# Altium project SOC v2.PrjPcb
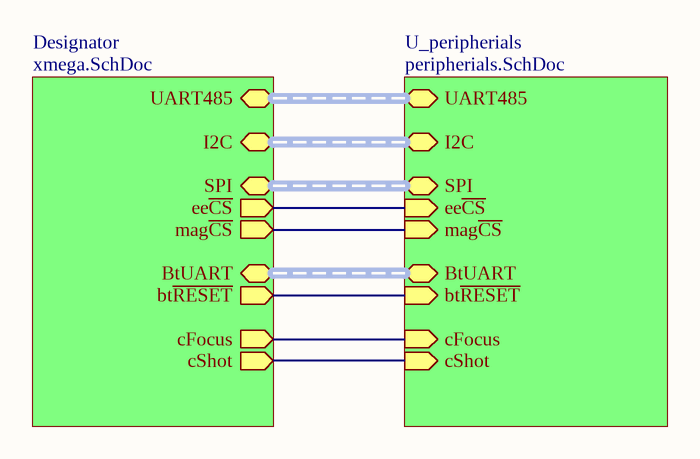
[diagram p0: schematics.SchDoc]
3 sheets, 97 parts. Net scope: hierarchical (ports join the sheet entries above them; power ports are global).
Board file: PtHeadMB.PcbDoc
Sheets:
  schematics.SchDoc
    Designator = xmega.SchDoc
    U_peripherials = peripherials.SchDoc

## Sheet schematics.SchDoc: Automatická videohlava
size A4; ApprovedBy: app by; CheckedBy: check by; Author: author; CompanyName: company; DrawnBy: Jiří Kyzlink; Organization: SPŠE Brno, Kounicova 16; Address1: L3, 12a Rodborough Rd; Address2: Frenchs Forest; Address3: NSW; Address4: Australia 2086; DocumentNumber: 1; Revision: A; SheetNumber: 1; SheetTotal: 3; DocumentName: doc name; ProjectName: hlava

### Sub-sheets
Designator = xmega.SchDoc: I2C (harness I2C), UART485 (harness UART485), BtUART (harness UART), SPI (harness SPI), ee~{CS} (out), mag~{CS} (out), bt~{RESET} (out), cFocus (out), cShot (out)
U_peripherials = peripherials.SchDoc: I2C (harness I2C), UART485 (harness rs485), SPI (harness SPI), BtUART (harness UART), ee~{CS} (in), mag~{CS} (in), bt~{RESET} (in), cShot (in), cFocus (in)

### Nets
~{mCS}: sheet Designator/mag~{CS}, sheet U_peripherials/mag~{CS}
NetQ1#1_5: sheet Designator/cShot, sheet U_peripherials/cShot
NetQ1#2_2: sheet Designator/cFocus, sheet U_peripherials/cFocus
NetR25_1: sheet Designator/ee~{CS}, sheet U_peripherials/ee~{CS}
NetU1_20: sheet Designator/bt~{RESET}, sheet U_peripherials/bt~{RESET}

### Buses and harness runs
harness sheet Designator/BtUART = sheet U_peripherials/BtUART
harness sheet Designator/I2C = sheet U_peripherials/I2C
harness sheet Designator/SPI = sheet U_peripherials/SPI
harness sheet Designator/UART485 = sheet U_peripherials/UART485

### Notes on the sheet
- Date:
- Size:
- Title
- A4
- Draw:
- Time:
- Revision:
- Sheet
- of
- File:

## Sheet xmega.SchDoc: Automatická videohlava
size A4; ApprovedBy: app by; CheckedBy: check by; Author: author; CompanyName: company; DrawnBy: Jiří Kyzlink; Organization: SPŠE Brno Kounicova 16; Address1: L3, 12a Rodborough Rd; Address2: Frenchs Forest; Address3: NSW; Address4: Australia 2086; DocumentNumber: 2; Revision: A; SheetNumber: 2; SheetTotal: 3; DocumentName: Sch; ProjectName: Hlava
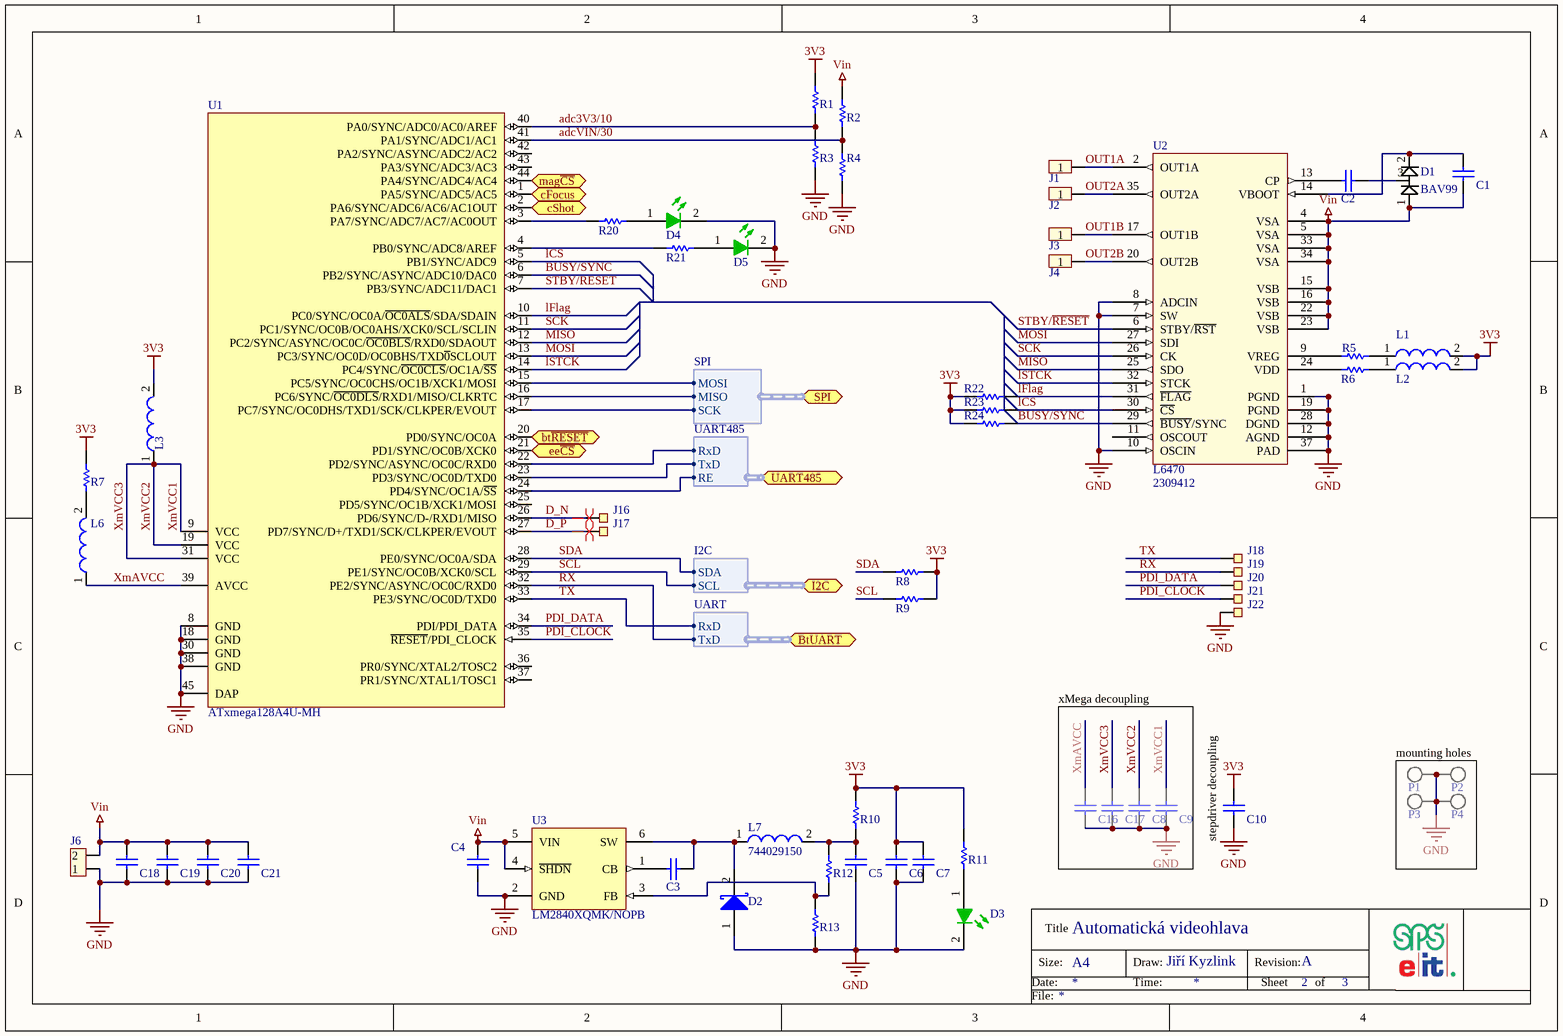
[diagram p1: xmega.SchDoc]

### Parts
C1  CAP 220nF 50V 0603(1608)  [CAPC0603(1608)100_L]  (value not drawn)
C2  CAP 10nF 16V 0402(1005)  [CAPC0402(1005)60_L]  (value not drawn)
C3  CAP 100nF 16V 0402(1005)  [CAPC0402(1005)60_L]  (value not drawn)
C4  CAP 2.2pF 50V 0402(1005)  [CAPC0402(1005)60_L]  (value not drawn)
C5  CAP 10uF 6.3V 0402(1005)  [CAPC0402(1005)60_L]  (value not drawn)
C6  CAP 10uF 6.3V 0402(1005)  [CAPC0402(1005)60_L]  (value not drawn)
C7  CAP 10uF 6.3V 0402(1005)  [CAPC0402(1005)60_L]  (value not drawn)
C8  CAP 100nF 6.3V 0402(1005)  [CAPC0402(1005)60_L]  (value not drawn)
C9  CAP 100nF 6.3V 0402(1005)  [CAPC0402(1005)60_L]  (value not drawn)
C10  CAP 100nF 6.3V 0402(1005)  [CAPC0402(1005)60_L]  (value not drawn)
C16  CAP 100nF 16V 0402(1005)  [CAPC0402(1005)60_L]  (value not drawn)
C17  CAP 100nF 6.3V 0402(1005)  [CAPC0402(1005)60_L]  (value not drawn)
C18  CAP 1uF 50V 0603(1608)  [CAPC0603(1608)100_L]  (value not drawn)
C19  CAP 1uF 50V 0603(1608)  [CAPC0603(1608)100_L]  (value not drawn)
C20  CAP 1uF 50V 0603(1608)  [CAPC0603(1608)100_L]  (value not drawn)
C21  CAP 1uF 50V 0603(1608)  [CAPC0603(1608)100_L]  (value not drawn)
D1  BAV99  [MCHP-SOT-23-NB3_N]
D2  ZHCS400  [DIOD-SOD323-2_V]  (value not drawn)
D3  KP-1608MGC  [KING-0603LED_GREEN_V]  (value not drawn)
D4  KP-1608MGC  [KING-0603LED_GREEN_V]  (value not drawn)
D5  KP-1608MGC  [KING-0603LED_GREEN_V]  (value not drawn)
J1  Pin  [Hole 1mm]  (value not drawn)
J2  Pin  [Hole 1mm]  (value not drawn)
J3  Pin  [Hole 1mm]  (value not drawn)
J4  Pin  [Hole 1mm]  (value not drawn)
J6  jumper  [header 2pin]  (value not drawn)
J16  smd pad  [pad 0.75x1.5mm]  (value not drawn)
J17  smd pad  [pad 0.75x1.5mm]  (value not drawn)
J18  smd pad  [pad 0.75x1.5mm]  (value not drawn)
J19  smd pad  [pad 0.75x1.5mm]  (value not drawn)
J20  smd pad  [pad 0.75x1.5mm]  (value not drawn)
J21  smd pad  [pad 0.75x1.5mm]  (value not drawn)
J22  smd pad  [pad 0.75x1.5mm]  (value not drawn)
L1  742843122  [0402]  (value not drawn)
L2  742843122  [0402]  (value not drawn)
L3  742843122  [0402]  (value not drawn)
L6  742843122  [0402]  (value not drawn)
L7  744029150  [WE-TPC-2813-TH]
P1  screw  [M3 screw]  (value not drawn)
P2  screw  [M3 screw]  (value not drawn)
P3  screw  [M3 screw]  (value not drawn)
P4  screw  [M3 screw]  (value not drawn)
R1  10K 1% 0402(1005)  [RESC0402(1005)_L]  (value not drawn)
R2  30K 1% 0402(1005)  [RESC0402(1005)_L]  (value not drawn)
R3  1K 1% 0402(1005)  [RESC0402(1005)_L]  (value not drawn)
R4  1K 1% 0402(1005)  [RESC0402(1005)_L]  (value not drawn)
R5  Jumper 0402(1005)  [RESC0402(1005)_L]  (value not drawn)
R6  Jumper 0402(1005)  [RESC0402(1005)_L]  (value not drawn)
R7  Jumper 0402(1005)  [RESC0402(1005)_L]  (value not drawn)
R8  4K7 1% 0402(1005)  [RESC0402(1005)_L]  (value not drawn)
R9  4K7 1% 0402(1005)  [RESC0402(1005)_L]  (value not drawn)
R10  Jumper 0402(1005)  [RESC0402(1005)_L]  (value not drawn)
R11  130R 5% 0402(1005)  [RESC0402(1005)_L]  (value not drawn)
R12  1K02 1% 0402(1005)  [RESC0402(1005)_L]  (value not drawn)
R13  3K4 1% 0402(1005)  [RESC0402(1005)_L]  (value not drawn)
R20  130R 5% 0402(1005)  [RESC0402(1005)_L]  (value not drawn)
R21  130R 5% 0402(1005)  [RESC0402(1005)_L]  (value not drawn)
R22  39K 5% 0402(1005)  [RESC0402(1005)_L]  (value not drawn)
R23  39K 5% 0402(1005)  [RESC0402(1005)_L]  (value not drawn)
R24  39K 5% 0402(1005)  [RESC0402(1005)_L]  (value not drawn)
U1  ATxmega128A4U-MH  [qfn 44pin]
U2  L6470  Supplier Part Number 1: 2309412  [POWERSO36]
U3  LM2840XQMK/NOPB  [MK06A_N]

### Blocks framed on the sheet
xMega decoupling: C8 C9 C16 C17
mounting holes: P1-P4

### Ports
BtUART (harness UART), bt~{RESET} (out), cFocus (out), cShot (out), ee~{CS} (out), I2C (harness I2C), mag~{CS} (out), SPI (harness SPI), UART485 (harness UART485)

### Harnesses
I2C: SCL, SDA
UART485: TxD, RxD, RE
UART: RxD, TxD
SPI: MOSI, MISO, SCK

### Nets
3V3: C6.2 C7.2 C10.1 L1.2 L2.2 L3.2 R1.2 R7.2 R8.2 R9.1 R10.2 R11.2 R22.1 R23.1 R24.1
GND: C4.1 C5.1 C6.1 C7.1 C8.2 C9.2 C10.2 C16.2 C17.2 C18.1 C19.1 C20.1 C21.1 D2.1(A) D3.2(K) D4.2(K) D5.2(K) J6.1 J22.0 P1.0 P2.0 P3.0 P4.0 R3.2 R4.2 R13.1 U1.8(GND) U1.18(GND) U1.30(GND) U1.38(GND) U1.45(DAP) U2.1(PGND) U2.7(SW) U2.8(ADCIN) U2.10(OSCIN) U2.12(AGND) U2.19(PGND) U2.28(DGND) U2.37(PAD) U3.2(GND)
Vin: C1.1 C4.2 C18.2 C19.2 C20.2 C21.2 D1.1 J6.2 R2.2 U2.4(VSA) U2.5(VSA) U2.15(VSB) U2.16(VSB) U2.22(VSB) U2.23(VSB) U2.33(VSA) U2.34(VSA) U3.4(~{SHDN}) U3.5(VIN)
adc3V3/10: R1.1 R3.1 U1.40(PA0/SYNC/ADC0/AC0/AREF)
adcVIN/30: R2.1 R4.1 U1.41(PA1/SYNC/ADC1/AC1)
BUSY/~{SYNC}: R24.2 U1.6(PB2/SYNC/ASYNC/ADC10/DAC0) U2.29(~{BUSY}/SYNC)
D_N: J16.0 U1.26(PD6/SYNC/D-/RXD1/MISO)
D_P: J17.0 U1.27(PD7/SYNC/D+/TXD1/SCK/CLKPER/EVOUT)
lCS: R23.2 U1.5(PB1/SYNC/ADC9) U2.30(~{CS})
lFlag: R22.2 U1.10(PC0/SYNC/OC0A/~{OC0ALS}/SDA/SDAIN) U2.31(~{FLAG})
lSTCK: U1.14(PC4/SYNC/~{OC0CLS}/OC1A/~{SS}) U2.32(STCK)
~{mCS}: U1.44(PA4/SYNC/ADC4/AC4) ; port mag~{CS}
MISO: U1.12(PC2/SYNC/ASYNC/OC0C/~{OC0BLS}/RXD0/SDAOUT) U2.25(SDO)
MISO: U1.16(PC6/SYNC/~{OC0DLS}/RXD1/MISO/CLKRTC) ; port SPI.MISO  [a separate net that carries the same name]
MOSI: U1.13(PC3/SYNC/OC0D/OC0BHS/TXD~{0}SCLOUT) U2.27(SDI)
MOSI: U1.15(PC5/SYNC/OC0CHS/OC1B/XCK1/MOSI) ; port SPI.MOSI  [a separate net that carries the same name]
OUT1A: J1.1 U2.2(OUT1A)
OUT1B: J3.1 U2.17(OUT1B)
OUT2A: J2.1 U2.35(OUT2A)
OUT2B: J4.1 U2.20(OUT2B)
PDI_CLOCK: J21.0 U1.35(~{RESET}/PDI_CLOCK)
PDI_DATA: J20.0 U1.34(PDI/PDI_DATA)
RX: J19.0 U1.32(PE2/SYNC/ASYNC/OC0C/RXD0) ; port BtUART.TxD
SCK: U1.11(PC1/SYNC/OC0B/OC0AHS/XCK0/SCL/SCLIN) U2.26(CK)
SCK: U1.17(PC7/SYNC/OC0DHS/TXD1/SCK/CLKPER/EVOUT) ; port SPI.SCK  [a separate net that carries the same name]
SCL: R9.2 U1.29(PE1/SYNC/OC0B/XCK0/SCL) ; port I2C.SCL
SDA: R8.1 U1.28(PE0/SYNC/OC0A/SDA) ; port I2C.SDA
STBY/~{RESET}: U1.7(PB3/SYNC/ADC11/DAC1) U2.6(STBY/~{RST})
TX: J18.0 U1.33(PE3/SYNC/OC0D/TXD0) ; port BtUART.RxD
XmAVCC: C16.1 L6.1 U1.39(AVCC)
XmVCC1: C8.1 C9.1 C17.1 L3.1 U1.9(VCC) U1.19(VCC) U1.31(VCC)  [also labelled XmVCC2, XmVCC3]
NetC1_2: C1.2 D1.2 U2.14(VBOOT)
NetC2_1: C2.1 U2.13(CP)
NetC2_2: C2.2 D1.3
NetC3_1: C3.1 U3.1(CB)
NetC3_2: C3.2 D2.2(K) L7.1 U3.6(SW)
NetC5_2: C5.2 L7.2 R10.1 R12.2
NetD3_1: D3.1(A) R11.1
NetD4_1: D4.1(A) R20.2
NetD5_1: D5.1(A) R21.2
NetL1_1: L1.1 R5.2
NetL2_1: L2.1 R6.2
NetL6_2: L6.2 R7.1
NetQ1#1_5: U1.2(PA6/SYNC/ADC6/AC6/AC1OUT) ; port cShot
NetQ1#2_2: U1.1(PA5/SYNC/ADC5/AC5) ; port cFocus
NetR5_1: R5.1 U2.9(VREG)
NetR6_1: R6.1 U2.24(VDD)
NetR12_1: R12.1 R13.2 U3.3(FB)
NetR20_1: R20.1 U1.3(PA7/SYNC/ADC7/AC7/AC0OUT)
NetR21_1: R21.1 U1.4(PB0/SYNC/ADC8/AREF)
NetR25_1: U1.21(PD1/SYNC/OC0B/XCK0) ; port ee~{CS}
NetU1_20: U1.20(PD0/SYNC/OC0A) ; port bt~{RESET}
NetU1_22: U1.22(PD2/SYNC/ASYNC/OC0C/RXD0) ; port UART485.RxD
NetU1_23: U1.23(PD3/SYNC/OC0D/TXD0) ; port UART485.TxD
NetU1_24: U1.24(PD4/SYNC/OC1A/~{SS}) ; port UART485.RE

Not connected (* = marked no-connect by the designer): U1 25(PD5/SYNC/OC1B/XCK1/MOSI) 36(PR0/SYNC/XTAL2/TOSC2) 37(PR1/SYNC/XTAL1/TOSC1) 42(PA2/SYNC/ASYNC/ADC2/AC2) 43(PA3/SYNC/ADC3/AC3); U2 11(OSCOUT)

### Layout directives
differential pair: D_N, D_P

### Notes on the sheet
- (near C10) stepdriver decoupling
- Date:
- Size:
- Title
- A4
- Draw:
- Time:
- Revision:
- Sheet
- of
- File:

### Library data of the parts
C1 = CMP-1035-02654-1: CAP 220nF 50V ±20% 0603 (1608 Metric) Thickness 1mm SMD; Case-Metric: 1608; Case-EIA: 0603; Max Thickness: 1 mm; Rated Voltage: 50 V; Value: 220nF; Tolerance: ±20%; Technology: SMT
C2 = CMP-1034-01876-1: CAP 10nF 16V ±10% 0402 (1005 Metric) Thickness 0.6mm SMD; Case-EIA: 0402; Case-Metric: 1005; Tolerance: ±10%; Rated Voltage: 16 V; Max Thickness: 0.6 mm; Technology: SMT; Value: 10nF
C3 C16 = CMP-1034-02069-1: CAP 100nF 16V ±10% 0402 (1005 Metric) Thickness 0.6mm SMD; Case-EIA: 0402; Case-Metric: 1005; Value: 100nF; Max Thickness: 0.6 mm; Tolerance: ±10%; Rated Voltage: 16 V; Technology: SMT
C4 = CMP-1034-00178-1: CAP 2.2pF 50V ±2% 0402 (1005 Metric) Thickness 0.6mm SMD; Case-Metric: 1005; Case-EIA: 0402; Max Thickness: 0.6 mm; Tolerance: ±2%; Technology: SMT; Value: 2.2pF; Rated Voltage: 50 V
C5-C7 = CMP-1034-02138-1: CAP 10uF 6.3V ±20% 0402 (1005 Metric) Thickness 0.6mm SMD; Case-Metric: 1005; Case-EIA: 0402; Tolerance: ±20%; Rated Voltage: 6.3 V; Technology: SMT; Max Thickness: 0.6 mm; Value: 10uF
C8-C10 C17 = CMP-1034-02060-1: CAP 100nF 6.3V ±5% 0402 (1005 Metric) Thickness 0.6mm SMD; Case-EIA: 0402; Case-Metric: 1005; Rated Voltage: 6.3 V; Max Thickness: 0.6 mm; Value: 100nF; Tolerance: ±5%; Technology: SMT
C18-C21 = CMP-1035-02745-1: CAP 1uF 50V ±10% 0603 (1608 Metric) Thickness 1mm SMD; Case-EIA: 0603; Case-Metric: 1608; Technology: SMT; Value: 1uF; Rated Voltage: 50 V; Max Thickness: 1 mm; Tolerance: ±10%
D2 = CMP-0303-00001-1: Schottky Diode, 400mA; Manufacturer: Diodes Inc; Reverse Voltage: 40 V; Power Dissipation: 250 mW; Reverse Current: 40 uA@Vr=30 V; Packing Type: Tape and Reel; Forward Voltage: 425 mV@If=400 mA; PartNumber: ZHCS400; Moisture Sensitivity Level: 1; ComponentLink2URL: http://www.diodes.com/datasheets/ZHCS400.pdf; PackageDescription: 2-Pin SMT Diode, 1.7 x 1.3 mm Body; ComponentLink2Description: Datasheet; PackageReference: SOD323; Mounting Technology: Surface Mount; DatasheetVersion: Rev. 8-2, 03/2012; Storage Temperature: -55 to 150 degC; PackageVersion: Rev. 73; ComponentLink3URL: http://www.diodes.com/datasheets/ap02002.pdf; ComponentLink1Description: Manufacturer URL; ComponentLink1URL: http://www.diodes.com/; ComponentLink3Description: Package Specification
D3-D5 = CMP-0404-00001-1: LED, SMT, 0603(1608), 1.1mm thickness, Green; Manufacturer: Kingbright; Reverse Voltage: 5 V; Power Dissipation: 75 mW; Forward Current: 30 mA; Packing Type: 2000 pcs / reel; Mounting Technology: Surface Mount; Storage Temperature: -40 to +85 degC; ComponentLink1URL: http://www.kingbright.com/; PackageDescription: 2-Pin SMT LED, 1.6 x 0.8 mm Pitch; PartNumber: KP-1608MGC; PackageReference: 0603LED_GREEN; ComponentLink1Description: Manufacturer URL
J6 = header 2pin
J16-J22 = pad
L1-L3 L6 = CMP-0220-00130-1: SMD EMI Suppression Ferrite Bead WE-CBF HF, Z = 220 Ohm; Impedance: 220 Ohm; PackageDescription: Chip Inductor, 2-Leads, Body 1.0 x 0.5 mm; PackageVersion: 2009; ComponentLink2Description: Datasheet; DatasheetVersion: ver 2, Aug-2009; ComponentLink1URL: http://www.we-online.com; ComponentLink2URL: http://www.we-online.de/katalog/media/pdf/742843122.pdf; PackageReference: SMD-0402; ComponentLink1Description: Manufacturer Link
L7 = CMP-0227-00078-1: SMD Shielded Tiny Power Inductor WE-TPC, L = 15.0 µH; Inductance: 15.0 µH; ComponentLink2URL: http://www.we-online.de/katalog/media/pdf/744029150.pdf; ComponentLink2Description: Datasheet; PackageVersion: 2010; PackageDescription: SMD Inductor, 2-Leads, Body 2.8 x 2.8 mm; ComponentLink1Description: Manufacturer Link; PackageReference: WE-TPC-2813-TH; ComponentLink1URL: http://www.we-online.com; DatasheetVersion: ver 3, Mar-2011
R1 = CMP-1011-00623-1: 10K 0.063W 1% 0402 (1005 Metric)  SMD; Case-Metric: 1005; Value: 10000.00 Ohm; Case-EIA: 0402; Tolerance: 1 %; Technology: SMT; Power: 0.063 W
R2 = CMP-1011-00675-1: 30K 0.063W 1% 0402 (1005 Metric)  SMD; Value: 30000.00 Ohm; Case-Metric: 1005; Case-EIA: 0402; Power: 0.063 W; Technology: SMT; Tolerance: 1 %
R3 R4 = CMP-1011-00510-1: 1K 0.063W 1% 0402 (1005 Metric)  SMD; Case-EIA: 0402; Value: 1000.00 Ohm; Case-Metric: 1005; Technology: SMT; Tolerance: 1 %; Power: 0.063 W
R5-R7 R10 = CMP-1011-00001-1: Jumper 0402 (1005 Metric); Tolerance: None; Case-Metric: 1005; Case-EIA: 0402; Value: 0.00 Ohm; Power: None; Technology: SMT
R8 R9 = CMP-1011-00586-1: 4K7 0.063W 1% 0402 (1005 Metric)  SMD; Case-Metric: 1005; Value: 4700.00 Ohm; Case-EIA: 0402; Power: 0.063 W; Technology: SMT; Tolerance: 1 %
R11 R20 R21 = CMP-1011-00053-1: 130R 0.063W 5% 0402 (1005 Metric)  SMD; Case-EIA: 0402; Case-Metric: 1005; Value: 130.00 Ohm; Technology: SMT; Power: 0.063 W; Tolerance: 5 %
R12 = CMP-1011-00511-1: 1K02 0.063W 1% 0402 (1005 Metric)  SMD; Value: 1020.00 Ohm; Case-EIA: 0402; Case-Metric: 1005; Technology: SMT; Tolerance: 1 %; Power: 0.063 W
R13 = CMP-1011-00569-1: 3K4 0.063W 1% 0402 (1005 Metric)  SMD; Case-EIA: 0402; Case-Metric: 1005; Value: 3400.00 Ohm; Tolerance: 1 %; Power: 0.063 W; Technology: SMT
R22-R24 = CMP-1011-00112-1: 39K 0.063W 5% 0402 (1005 Metric)  SMD; Case-Metric: 1005; Value: 39000.00 Ohm; Case-EIA: 0402; Technology: SMT; Tolerance: 5 %; Power: 0.063 W
U1 = CMP-0094-00056-2: 8/16-bit AVR XMEGA A4U Microcontroller, 1.6-3.6V, 32MHz, 128K + 8KB Flash, 2K EEPROM, 8K SRAM, 44-pin VQFN, Industrial Grade (-40°C to 85°C); Manufacturer: Atmel; PartNumber: ATxmega128A4U-MH; PackageReference: 44M1; RevisionNote: Pin10中OC0ALS加bar，加上SDAIN;Pin11加上SCLIN;Pin12中OC0BLS加bar，加上SDAOUT;Pin13加上SCLOUT;Pin14中OC0CLS加bar；Pin16中OC0DLS加bar，clk大写；Pin17中clk大写；Pin27中clk大写；矩形框缩短; ComponentLink1Description: Manufacturer URL; ComponentLink2URL: http://www.atmel.com/Images/Atmel-8387-8-and16-bit-AVR-Microcontroller-XMEGA-A4U_Datasheet.pdf; PackageDescription: 44-Pin Plastic Very Thin Quad Flat No-Lead Package, 7 x 7 x 1.0 mm Body, 0.5 mm Pitch (VQFN), 5.2 mm Exposed Pad; ComponentLink1URL: http://www.atmel.com/; Code_JEDEC: MO-220-VKKD-1; ComponentLink2Description: Datasheet; DatasheetVersion: revF, Jan-2014; PackageVersion: revH, Sep-2008
U3 = CMP-0063-01534-1: 100 mA up to 42V Input Step-Down DC/DC Regulator, Automotive Grade 1, Thin 6-pin SOT23, Pb-Free, 1000 Reel; Manufacturer: National Semiconductor; High-Reliability: Y; PowerWise: N; PackageTopMarking: SE9B*XTT; CompType: MiscPower; ComponentLink4Description: MK06A Package Page; ComponentLink1Description: Manufacturer URL; PackageVersion: revE, Nov-2008; ComponentLink2Description: LM2840 Datasheet; ComponentLink4URL: http://www.national.com/packaging/folders/mk06a.html; PartNumber: LM2840XQMK/NOPB; PackageDescription: Molded TSOT, 2.97 x 1.65 x 0.87mm Body, 6 Lead, 0.95mm Pitch; ComponentLink3URL: http://www.national.com/pf/LM/LM2840.html; Code_JEDEC: MO-193-AA; ComponentLink1URL: http://www.national.com/; ComponentLink3Description: LM2840 Web Page; ComponentLink2URL: http://www.national.com/ds/LM/LM2840.pdf; RoHS: Y; PinCount: 6; DatasheetVersion: Aug-2011; Code_IPC: SOT26A-6; PackageReference: MK06A
U2 = L6470: Supplier 1: Farnell

## Sheet peripherials.SchDoc: Automatická videohlava
size A4; ApprovedBy: app by; CheckedBy: check by; Author: author; CompanyName: company; DrawnBy: Jiří Kyzlink; Organization: SPŠE Brno, Kounicova 16; Address1: L3, 12a Rodborough Rd; Address2: Frenchs Forest; Address3: NSW; Address4: Australia 2086; DocumentNumber: 3; Revision: A; SheetNumber: 3; SheetTotal: 3; DocumentName: hlava; ProjectName: hlava
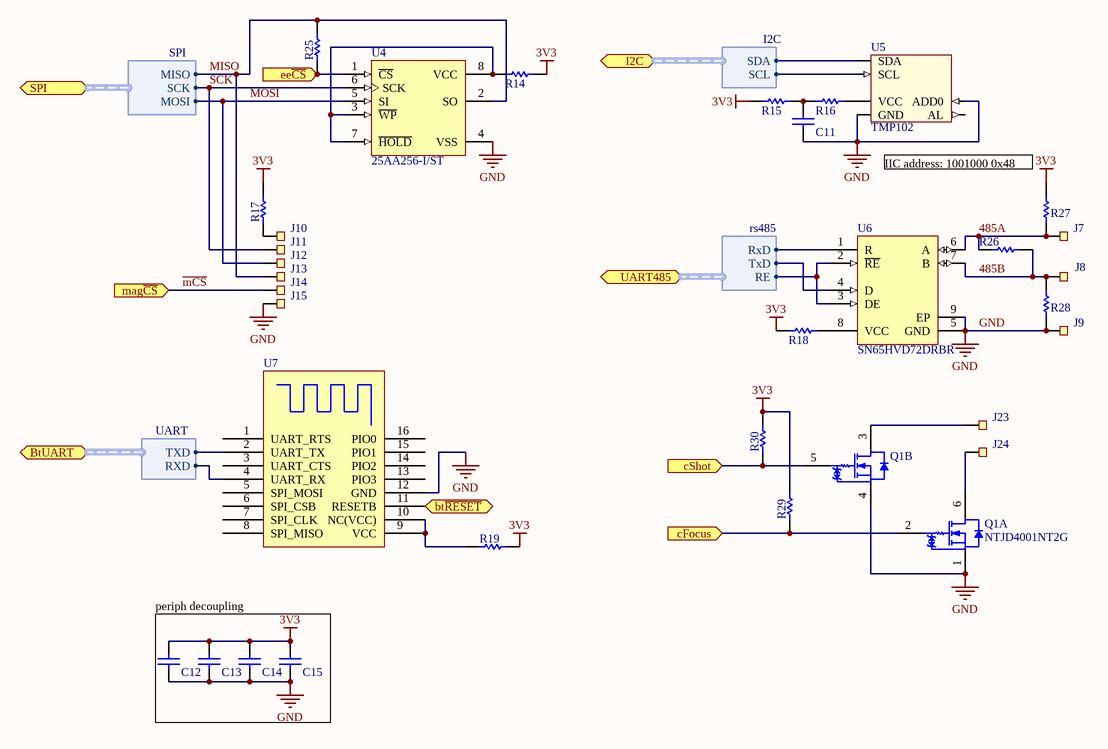
[diagram p2: peripherials.SchDoc]

### Parts
(Parts that share a designator on the sheet are numbered #1, #2 ... from top to bottom, then left to right.)
C11  CAP 100nF 6.3V 0402(1005)  [CAPC0402(1005)60_L]  (value not drawn)
C12  CAP 100nF 6.3V 0402(1005)  [CAPC0402(1005)60_L]  (value not drawn)
C13  CAP 100nF 6.3V 0402(1005)  [CAPC0402(1005)60_L]  (value not drawn)
C14  CAP 100nF 6.3V 0402(1005)  [CAPC0402(1005)60_L]  (value not drawn)
C15  CAP 100nF 6.3V 0402(1005)  [CAPC0402(1005)60_L]  (value not drawn)
J7  smd pad  [pad 0.75x1.5mm]  (value not drawn)
J8  smd pad  [pad 0.75x1.5mm]  (value not drawn)
J9  smd pad  [pad 0.75x1.5mm]  (value not drawn)
J10  smd pad  [pad 0.75x1.5mm]  (value not drawn)
J11  smd pad  [pad 0.75x1.5mm]  (value not drawn)
J12  smd pad  [pad 0.75x1.5mm]  (value not drawn)
J13  smd pad  [pad 0.75x1.5mm]  (value not drawn)
J14  smd pad  [pad 0.75x1.5mm]  (value not drawn)
J15  smd pad  [pad 0.75x1.5mm]  (value not drawn)
J23  smd pad  [pad 0.75x1.5mm]  (value not drawn)
J24  smd pad  [pad 0.75x1.5mm]  (value not drawn)
Q1#1  NTJD4001NT2G  [ONSC-SOT-363-6-419B-02_W_V]  (value not drawn)  (part B of 2)
Q1#2  NTJD4001NT2G  [ONSC-SOT-363-6-419B-02_W_V]  (part A of 2)
R14  Jumper 0402(1005)  [RESC0402(1005)_L]  (value not drawn)
R15  Jumper 0402(1005)  [RESC0402(1005)_L]  (value not drawn)
R16  4K7 1% 0402(1005)  [RESC0402(1005)_L]  (value not drawn)
R17  Jumper 0402(1005)  [RESC0402(1005)_L]  (value not drawn)
R18  Jumper 0402(1005)  [RESC0402(1005)_L]  (value not drawn)
R19  Jumper 0402(1005)  [RESC0402(1005)_L]  (value not drawn)
R25  39K 5% 0402(1005)  [RESC0402(1005)_L]  (value not drawn)
R26  120R 5% 0402(1005)  [RESC0402(1005)_L]  (value not drawn)
R27  560R 5% 0402(1005)  [RESC0402(1005)_L]  (value not drawn)
R28  560R 5% 0402(1005)  [RESC0402(1005)_M]  (value not drawn)
R29  39K 5% 0402(1005)  [RESC0402(1005)_L]  (value not drawn)
R30  39K 5% 0402(1005)  [RESC0402(1005)_L]  (value not drawn)
U4  25AA256-I/ST  [TSSOP-ST8_L]
U5  TMP102  [DRL6]
U6  SN65HVD72DRBR  [TI-DRB8-2400X1650TP_V]
U7  www.jnhuamao.cn  [HM_05_06_07_11]  (value not drawn)

### Blocks framed on the sheet
periph decoupling: C12-C15

### Ports
BtUART (harness UART), bt~{RESET} (in), cFocus (in), cShot (in), ee~{CS} (in), I2C (harness I2C), mag~{CS} (in), SPI (harness SPI), UART485 (harness rs485)

### Harnesses
I2C: SCL, SDA
rs485: RE, RxD, TxD
SPI: MISO, MOSI, SCK
UART: RXD, TXD

### Nets
3V3: C12.1 C13.1 C14.1 C15.1 R14.2 R15.1 R17.2 R18.1 R19.2 R27.2 R29.2 R30.2
GND: C11.1 C12.2 C13.2 C14.2 C15.2 J9.0 J15.0 Q1#1.4(S2) Q1#2.1(S1) R28.1 U4.4(VSS) U5.2(GND) U5.4(ADD0) U6.5(GND) U6.9(EP) U7.12(GND)
485A: J7.0 R26.1 R27.1 U6.6(A)
485B: J8.0 R26.2 R28.2 U6.7(B)
~{mCS}: J14.0 ; port mag~{CS}
MISO: J13.0 R25.2 U4.2(SO) ; port SPI.MISO
MOSI: J12.0 U4.5(SI) ; port SPI.MOSI
RX: U7.2(UART_TX) ; port BtUART.TXD
SCK: J11.0 U4.6(SCK) ; port SPI.SCK
SCL: U5.1(SCL) ; port I2C.SCL
SDA: U5.6(SDA) ; port I2C.SDA
TX: U7.4(UART_RX) ; port BtUART.RXD
NetC11_2: C11.2 R15.2 R16.2
NetJ10_0: J10.0 R17.1
NetJ23_0: J23.0 Q1#1.3(D2)
NetJ24_0: J24.0 Q1#2.6(D1)
NetQ1#1_5: Q1#1.5(G2) R30.1 ; port cShot
NetQ1#2_2: Q1#2.2(G1) R29.1 ; port cFocus
NetR14_1: R14.1 U4.3(~{WP}) U4.7(~{HOLD}) U4.8(VCC)
NetR16_1: R16.1 U5.5(VCC)
NetR18_2: R18.2 U6.8(VCC)
NetR19_1: R19.1 U7.9(VCC) U7.10(NC(VCC))
NetR25_1: R25.1 U4.1(~{CS}) ; port ee~{CS}
NetU1_20: U7.11(RESETB) ; port bt~{RESET}
NetU1_22: U6.1(R) ; port UART485.RxD
NetU1_23: U6.4(D) ; port UART485.TxD
NetU1_24: U6.2(~{RE}) U6.3(DE) ; port UART485.RE

Not connected (* = marked no-connect by the designer): U5 3(AL); U7 1(UART_RTS) 3(UART_CTS) 5(SPI_MOSI) 6(SPI_CSB) 7(SPI_CLK) 8(SPI_MISO) 13(PIO3) 14(PIO2) 15(PIO1) 16(PIO0)

### Notes on the sheet
- IIC address: 1001000 0x48
- Date:
- Size:
- Title
- A4
- Draw:
- Time:
- Revision:
- Sheet
- of
- File:

### Library data of the parts
C11-C15 = CMP-1034-02060-1: as C8 on sheet xmega; Rated Voltage: 6.3 V; Max Thickness: 0.6 mm; Value: 100nF; Tolerance: ±5%; Technology: SMT
J7-J15 J23 J24 = pad
Q1#1 Q1#2 = CMP-1058-00811-1: Small Signal MOSFET 30 V, 250 mA, Dual N-Channel, 6-Pin SOT-363, Pb-Free, Tape and Reel; Manufacturer: On Semiconductor; VGS Max (V): 20; Coss Typ (pF): 19; ID Max (A): 0.25; PD Max (W): 0.272; Channel Polarity: N Channel; VGS(th) Max (V): 1.5; Crss Typ (pF): 7.25; V(BR)DSS Min (V): 30; Package Type: SC-88-6 / SC-70-6 / SOT-363-6; PackageVersion: Rev. W, 01/2006; Configuration: Dual; PackageDescription: 6-Pin Small Outline Transistor, Body 2 x 1.25 mm, Pitch 0.65 mm; ComponentLink1Description: Manufacturer URL; PartNumber: NTJD4001NT2G; Ciss Typ (pF): 20; ComponentLink1URL: http://www.onsemi.com/; Packing: Tape and Reel; ComponentLink3URL: http://www.onsemi.com/pub_link/Collateral/NTJD4001N-D.PDF; ComponentLink3Description: Package Specification; Mounting Technology: Surface Mount; DatasheetVersion: Rev. 6; RoHS: Pb-Free; ComponentLink2URL: http://www.onsemi.com/pub_link/Collateral/NTJD4001N-D.PDF; PackageReference: SOT-363-6-419B-02_W; ComponentLink2Description: Datasheet
R14 R15 R17-R19 = CMP-1011-00001-1: as R5 on sheet xmega; Power: None; Technology: SMT
R16 = CMP-1011-00586-1: as R8 on sheet xmega; Power: 0.063 W; Technology: SMT; Tolerance: 1 %
R25 R29 R30 = CMP-1011-00112-1: as R22 on sheet xmega; Technology: SMT; Tolerance: 5 %; Power: 0.063 W
R26 = CMP-1011-00052-1: 120R 0.063W 5% 0402 (1005 Metric)  SMD; Value: 120.00 Ohm; Case-EIA: 0402; Case-Metric: 1005; Technology: SMT; Tolerance: 5 %; Power: 0.063 W
R27 R28 = CMP-1011-00068-1: 560R 0.063W 5% 0402 (1005 Metric)  SMD; Case-Metric: 1005; Case-EIA: 0402; Value: 560.00 Ohm; Tolerance: 5 %; Power: 0.063 W; Technology: SMT
U4 = CMP-0165-00405-1: 256K SPI Bus Serial EEPROM, 8-Pin TSSOP, Industrial Temperature; Code_JEDEC: MO-153; DatasheetVersion: revF, May-2007; PackageDescription: 8-Lead Plastic Thin Shrink Small Outline (ST) - 4.4mm Body [TSSOP]; PackageReference: TSSOP-ST8; PackageVersion: revBB, Aug-2009
U5 = TMP102: Low Power Digital Temperature Sensor  With SMBus™/Two-Wire Serial Interface in SOT563; PART#: TMP102AIDRLT
U6 = CMP-0694-00017-1: 3.3 V Supply RS-485 with IEC ESD Protection, 0.25 Mbps, -40 to 125 degC, 8-Pin SON, RoHS, Tape and Reel; Manufacturer: Texas Instruments; VCC: 3 to 3.6 V; No. of TX: 1; ICC (Max) (mA): 0.95; Signaling Rate (Max) (Mbps): 0.25; VI: -7 to 12 V; ESD: 15 kV; ComponentLink3Description: Package Specification; No. of RX: 1; ComponentLink2URL: http://www.ti.com/lit/ds/sllse11c/sllse11c.pdf; ComponentLink2Description: Datasheet; DatasheetVersion: SLLSE11C; PackageVersion: 4203482-2/K; PartNumber: SN65HVD72DRBR; RoHS: TRUE; PackageReference: DRB-8; Operating Temperature Range: -40 to 125 degC; ComponentLink1Description: Manufacturer URL; Packing: Tape and Reel; PackageDescription: 8-Pin Plastic Small Outline No-Lead, Body 3 x 3 mm, Pitch 0.65 mm; Mounting Technology: Surface Mount; ComponentLink3URL: http://www.ti.com/lit/ds/sllse11c/sllse11c.pdf; ComponentLink1URL: http://www.ti.com/
U7 = HM_05_06_07_11: HM bluetooth module HM-05,HM-06,HM-07, HM-11

## Nets that join several sheets
3V3: xmega (15 pins), peripherials (12 pins)
GND: xmega (40 pins), peripherials (16 pins)
~{mCS}: xmega (U1.44), peripherials (J14.0)
MISO: xmega (U1.16), peripherials (J13.0 R25.2 U4.2)
MOSI: xmega (U1.15), peripherials (J12.0 U4.5)
NetQ1#1_5: xmega (U1.2), peripherials (Q1#1.5 R30.1)
NetQ1#2_2: xmega (U1.1), peripherials (Q1#2.2 R29.1)
NetR25_1: xmega (U1.21), peripherials (R25.1 U4.1)
NetU1_20: xmega (U1.20), peripherials (U7.11)
NetU1_22: xmega (U1.22), peripherials (U6.1)
NetU1_23: xmega (U1.23), peripherials (U6.4)
NetU1_24: xmega (U1.24), peripherials (U6.2 U6.3)
RX: xmega (J19.0 U1.32), peripherials (U7.2)
SCK: xmega (U1.17), peripherials (J11.0 U4.6)
SCL: xmega (R9.2 U1.29), peripherials (U5.1)
SDA: xmega (R8.1 U1.28), peripherials (U5.6)
TX: xmega (J18.0 U1.33), peripherials (U7.4)